# EasyEDA schematic Wonderswan_1.5v_regulator EasyEDA.json
TITLE: Sheet_1; REV: 1.0; Date: 2023-03-22; Sheet: 1/1; Drawn By: jtiphaine; Company: Your Company
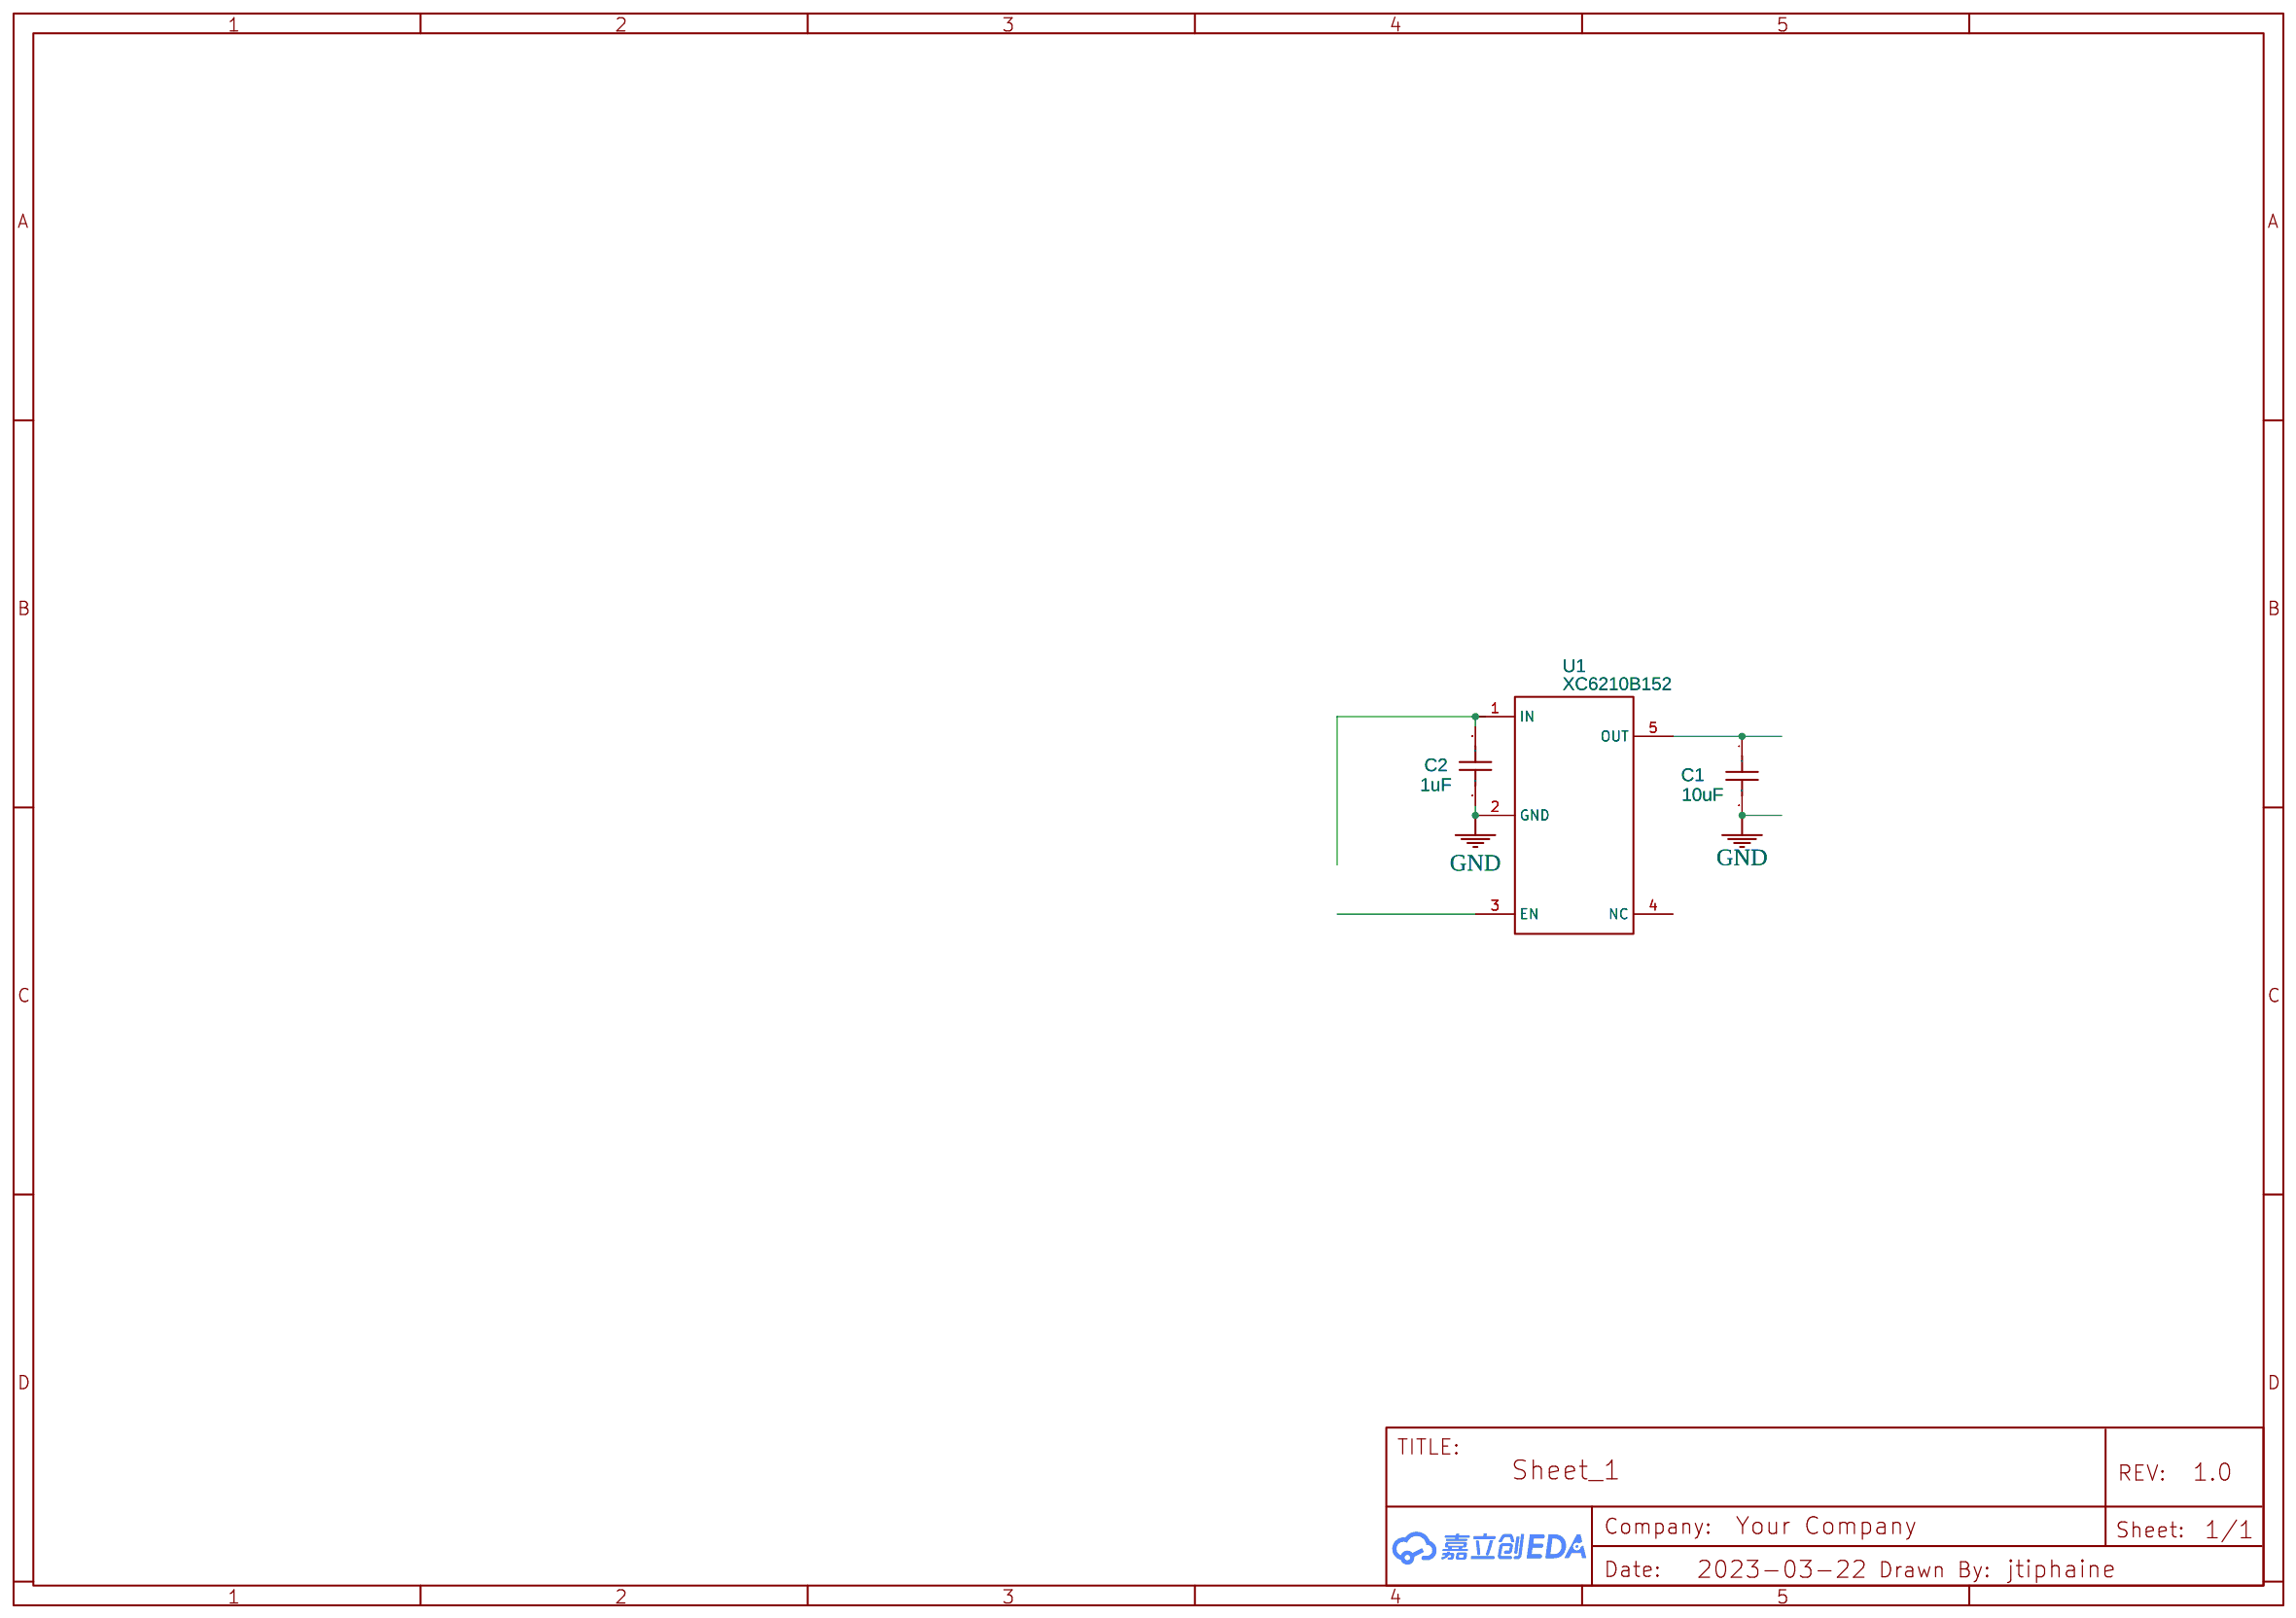
[diagram p0: schematic sheet]

## Parts
C1  10uF  [C0805]
C2  1uF  [C0805]
U1  XC6210B152  [SOT-23-5]

## Library data of the parts
C1 = 0805X106K160NT: Supplier: LCSC; Manufacturer: FH(风华); Supplier Part: C89189; JLCPCB Part Class: Extended Part
C2 = 0805B105K250NT: Supplier: LCSC; Manufacturer: FH(风华); Supplier Part: C89190; JLCPCB Part Class: Extended Part
U1 = XC6210B152: Manufacturer Part: XC6210B152MR-G; link: https://eu.mouser.com/ProductDetail/Torex-Semiconductor/XC6210B152MR-G?qs=AsjdqWjXhJ%252B%252BiUEWWNWa%2Fg%3D%3D; Contributor: M Aitesam; Supplier: Mouser; Supplier Part: 865-XC6210B152MR-G; Manufacturer: TOREX

## Nets
GND: C1.2 C2.1 U1.2(GND)
Net-(C1-1): C1.1 U1.5(OUT)
Net-(C2-2): C2.2 U1.1(IN)

Not connected (* = marked no-connect by the designer): U1 3(EN) 4(NC)
